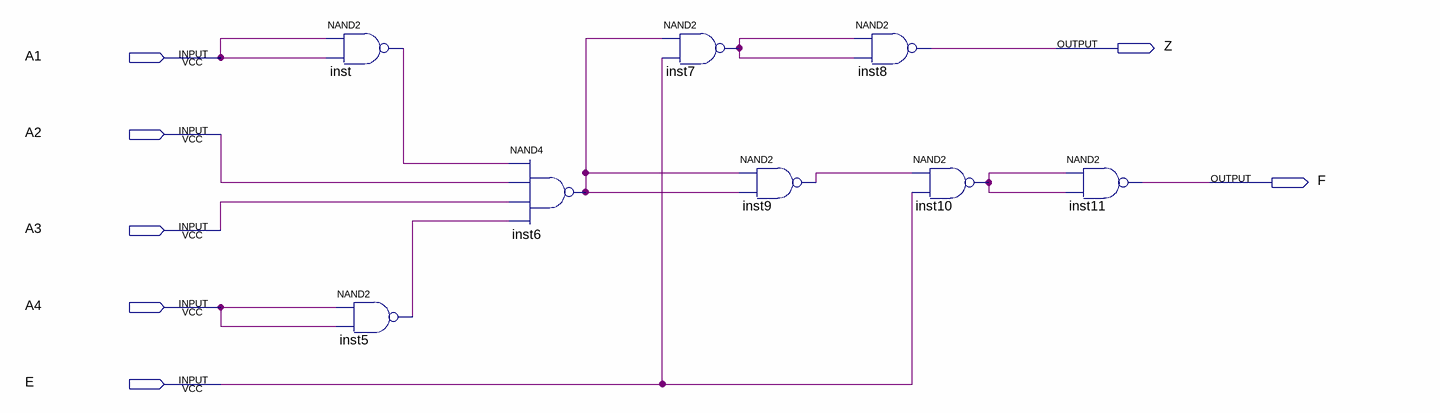
[diagram p0: schematic sheet]
// Quartus schematic Password.bdf as structural Verilog: 8 symbols, 7 pins
module Password (
  input  A1,
  input  A2,
  input  A3,
  input  A4,
  input  E,
  output Z,
  output F
);

  wire inst5_out, inst6_out, inst7_out, inst9_out, inst10_out, inst_out;

  nand inst (inst_out, A1, A1);
  nand inst5 (inst5_out, A4, A4);
  nand inst6 (inst6_out, inst_out, A2, A3, inst5_out);
  nand inst7 (inst7_out, inst6_out, E);
  nand inst9 (inst9_out, inst6_out, inst6_out);
  nand inst8 (Z, inst7_out, inst7_out);
  nand inst10 (inst10_out, inst9_out, E);
  nand inst11 (F, inst10_out, inst10_out);
endmodule
